# Altium schematic sheet PCIe to SATA.SchDoc
size 609 x 431 mm
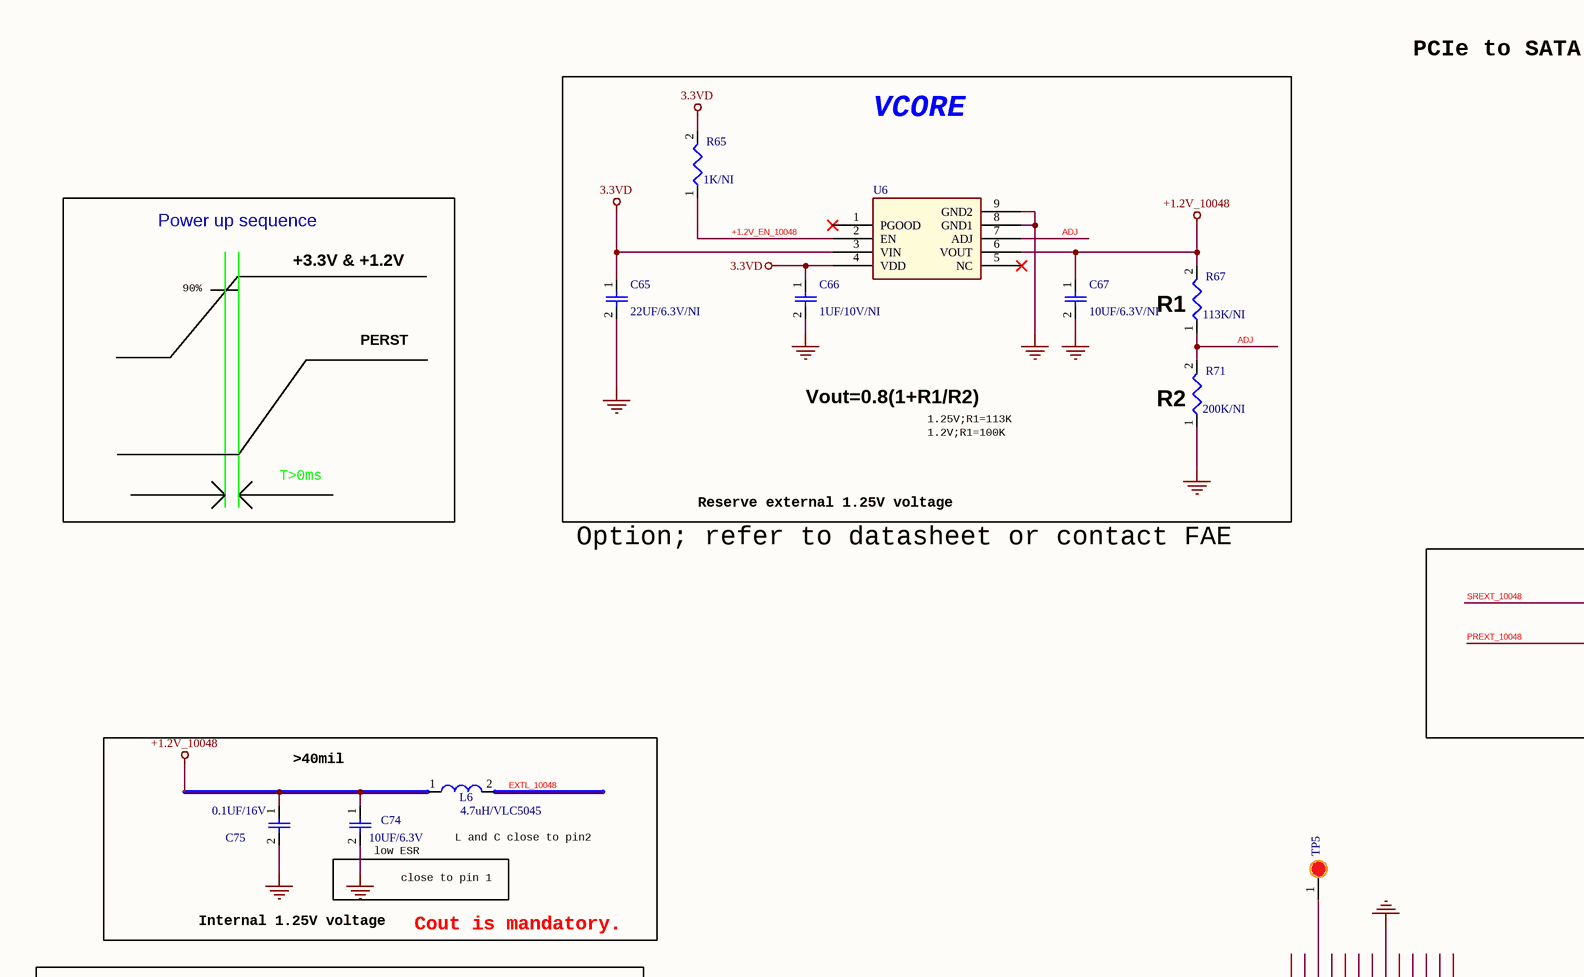
[diagram p0: PCIe to SATA.SchDoc, top left]
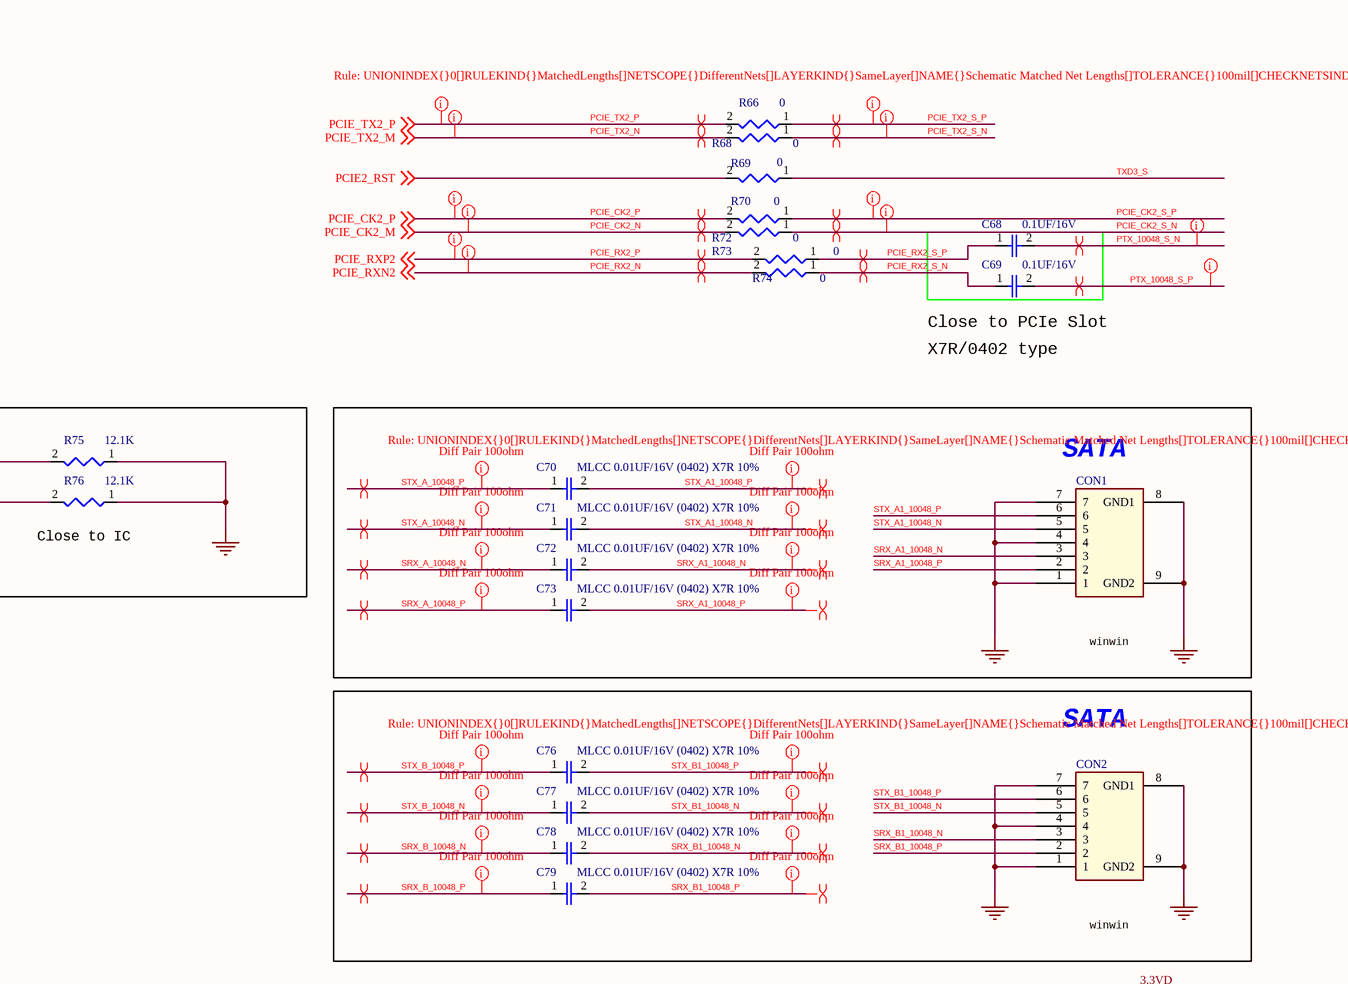
[diagram p1: PCIe to SATA.SchDoc, top right]
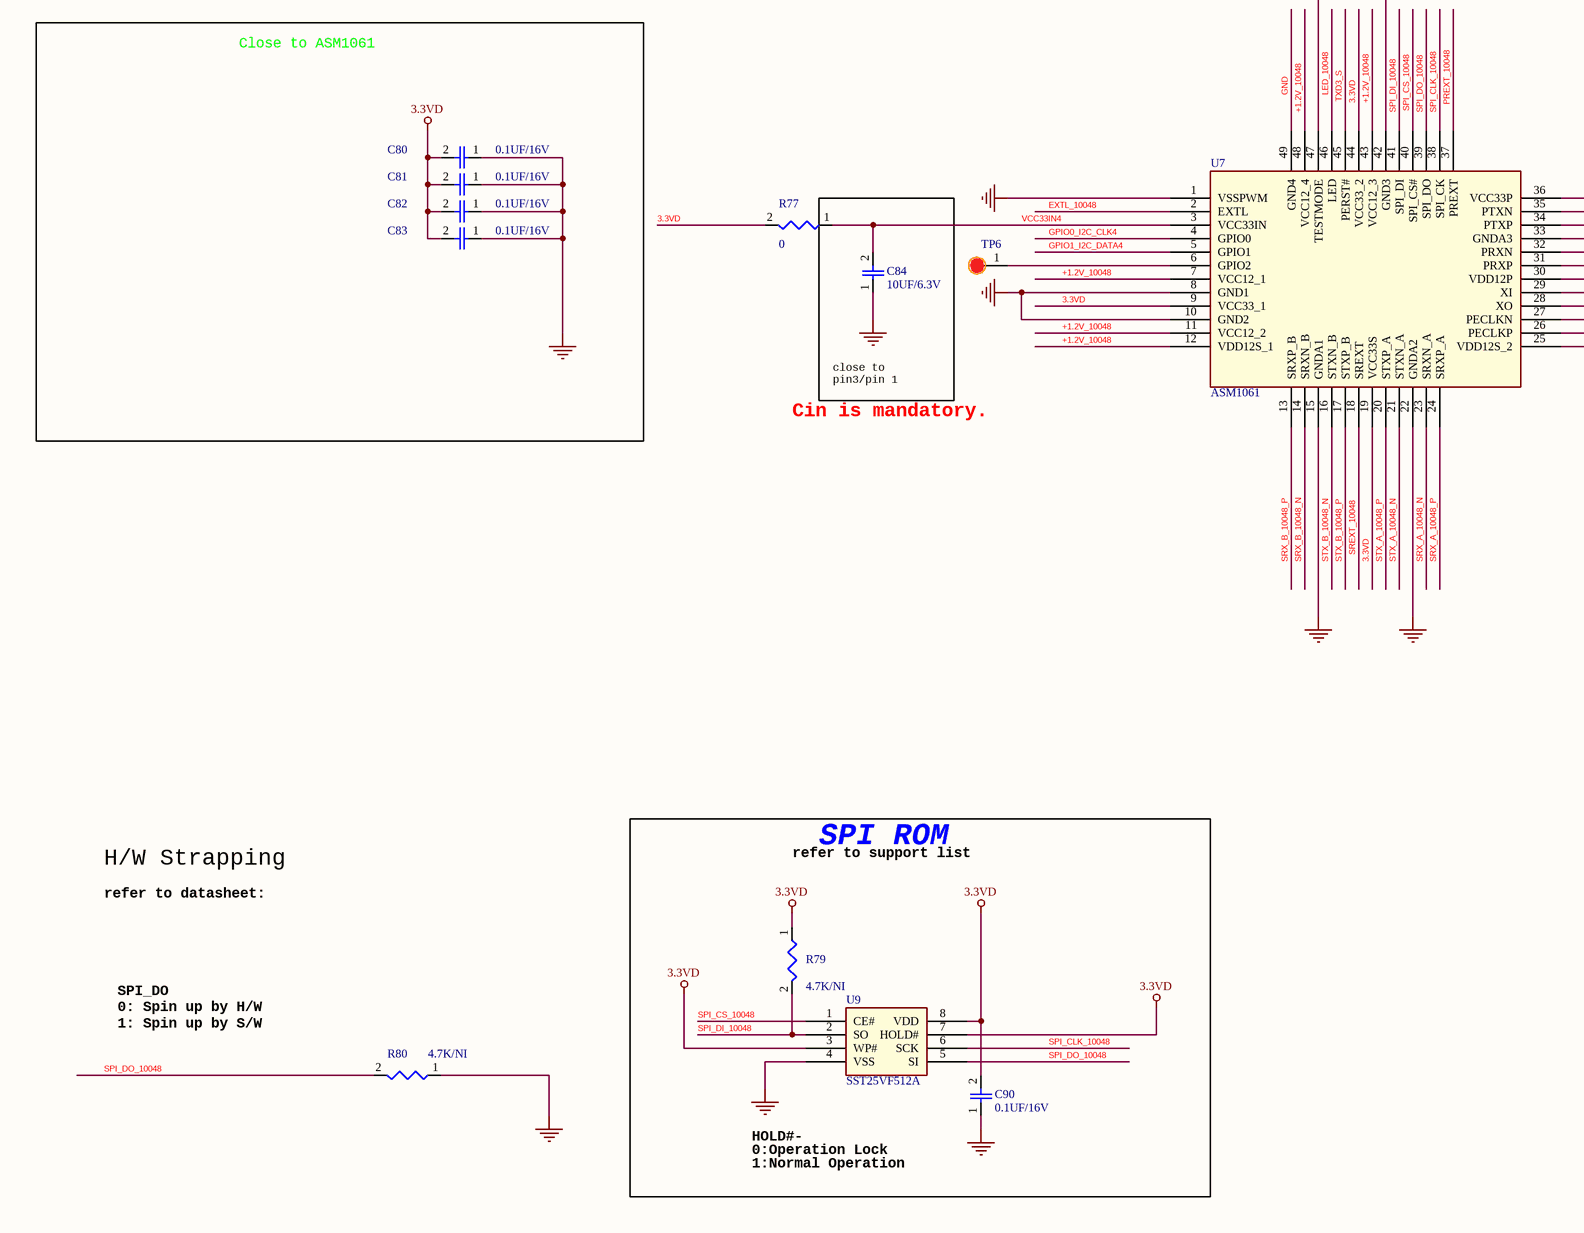
[diagram p2: PCIe to SATA.SchDoc, bottom left]
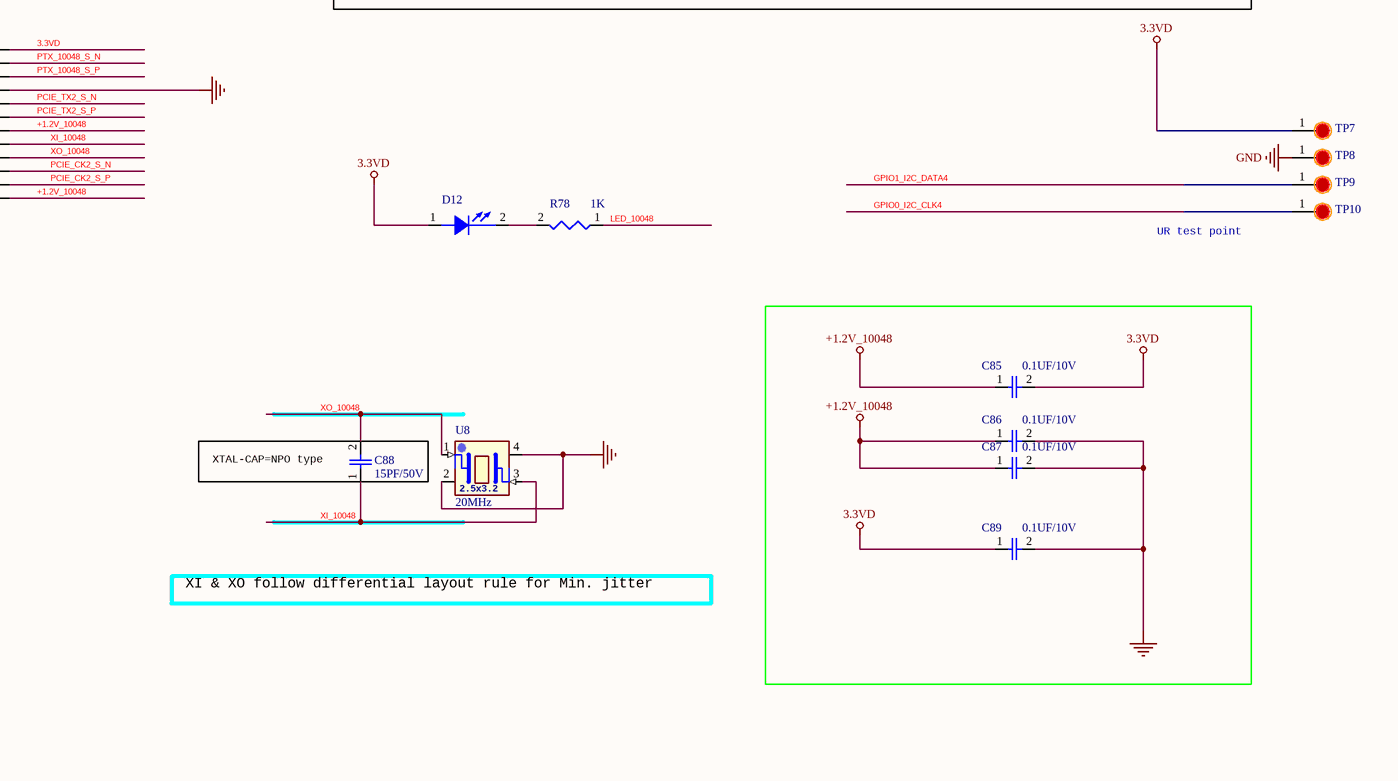
[diagram p3: PCIe to SATA.SchDoc, bottom right]

## Parts
C65  22UF/6.3V/NI  [0805-C]
C66  1UF/10V/NI  [0402-C]
C67  10UF/6.3V/NI  [0603-C]
C68  0.1UF/16V  [0402-C]
C69  0.1UF/16V  [0402-C]
C70  MLCC 0.01UF/16V (0402) X7R 10%  [0402-C]
C71  MLCC 0.01UF/16V (0402) X7R 10%  [0402-C]
C72  MLCC 0.01UF/16V (0402) X7R 10%  [0402-C]
C73  MLCC 0.01UF/16V (0402) X7R 10%  [0402-C]
C74  10UF/6.3V  [0603-C]
C75  0.1UF/16V  [0402-C]
C76  MLCC 0.01UF/16V (0402) X7R 10%  [0402-C]
C77  MLCC 0.01UF/16V (0402) X7R 10%  [0402-C]
C78  MLCC 0.01UF/16V (0402) X7R 10%  [0402-C]
C79  MLCC 0.01UF/16V (0402) X7R 10%  [0402-C]
C80  0.1UF/16V  [0402-C]
C81  0.1UF/16V  [0402-C]
C82  0.1UF/16V  [0402-C]
C83  0.1UF/16V  [0402-C]
C84  10UF/6.3V  [0603-C]
C85  0.1UF/10V  [0402-C]
C86  0.1UF/10V  [0402-C]
C87  0.1UF/10V  [0402-C]
C88  15PF/50V  [0402-C]
C89  0.1UF/10V  [0402-C]
C90  0.1UF/16V  [0402-C]
CON1  SATA_CON_7P_2HOLD  [0678008025]  (value not drawn)
CON2  SATA_CON_7P_2HOLD  [0678008025]  (value not drawn)
D12  LED/0603  [LED_0603]  (value not drawn)
L6  4.7uH/VLC5045  [VLC5045]
R65  1K/NI  [0603-R]
R66  0  [0402-R]
R67  113K/NI  [0402-R]
R68  0  [0402-R]
R69  0  [0402-R]
R70  0  [0402-R]
R71  200K/NI  [0402-R]
R72  0  [0402-R]
R73  0  [0402-R]
R74  0  [0402-R]
R75  12.1K  [0402-R]
R76  12.1K  [0402-R]
R77  0  [0603-R]
R78  1K  [0603-R]
R79  4.7K/NI  [0603-R]
R80  4.7K/NI  [0603-R]
TP5  TP  [TP_SMD]  (value not drawn)
TP6  TP  [TP_SMD]  (value not drawn)
TP7  TP  [TP_SMD]  (value not drawn)
TP8  TP  [TP_SMD]  (value not drawn)
TP9  TP  [TP_SMD]  (value not drawn)
TP10  TP  [TP_SMD]  (value not drawn)
U6  RT9025_25PSP/NI  [SOP-8]  (value not drawn)
U7  ASM1061  [QFN-48]
U8  20MHz  [XTAL_3.2x2.5]
U9  SST25VF512A  [SO-8]

## Blocks framed on the sheet
VCORE: C65-C67 R65 R67 R71 U6
Close to IC: R75 R76
SATA: C70-C73 CON1
Cout is mandatory.: C74 C75 L6
SATA: C76-C79 CON2
Close to ASM1061: C80-C83
XTAL-CAP=NPO type: C88
SPI ROM: C90 R79 U9

## Nets
3.3VD: C65.1 C66.1 C80.2 C81.2 C82.2 C83.2 C85.2 C89.1 C90.2 D12.1(ANODE) R65.2 R77.2 R79.1 TP7.1 U6.3(VIN) U6.4(VDD) U7.9(VCC33_1) U7.19(VCC33S) U7.36(VCC33P) U7.44(VCC33_2) U9.3(WP#) U9.7(HOLD#) U9.8(VDD)
+1.2V_10048: C67.1 C74.1 C75.1 C85.1 C86.1 C87.1 L6.1 R67.2 U6.6(VOUT) U7.7(VCC12_1) U7.11(VCC12_2) U7.12(VDD12S_1) U7.25(VDD12S_2) U7.30(VDD12P) U7.43(VCC12_3) U7.48(VCC12_4)
GND: C65.2 C66.2 C67.2 C74.2 C75.2 C80.1 C81.1 C82.1 C83.1 C84.1 C86.2 C87.2 C89.2 C90.1 CON1.1 CON1.4 CON1.7 CON1.8(GND1) CON1.9(GND2) CON2.1 CON2.4 CON2.7 CON2.8(GND1) CON2.9(GND2) R71.1 R75.1 R76.1 R80.1 TP8.1 U6.8(GND1) U6.9(GND2) U7.1(VSSPWM) U7.8(GND1) U7.10(GND2) U7.15(GNDA1) U7.22(GNDA2) U7.33(GNDA3) U7.42(GND3) U7.49(GND4) U8.2(NC) U8.4(NC) U9.4(VSS)
+1.2V_EN_10048: R65.1 U6.2(EN)
ADJ: R67.1 R71.2 U6.7(ADJ)
EXTL_10048: L6.2 U7.2(EXTL)
GPIO0_I2C_CLK4: TP10.1 U7.4(GPIO0)
GPIO1_I2C_DATA4: TP9.1 U7.5(GPIO1)
LED_10048: R78.1 U7.46(LED)
PCIE2_RST: R69.2 ; off-sheet PCIE2_RST
PCIE_CK2_N: R72.2 ; off-sheet PCIE_CK2_M  [also labelled PCIE_CK2_M]
PCIE_CK2_P: R70.2 ; off-sheet PCIE_CK2_P
PCIE_CK2_S_N: R72.1 U7.27(PECLKN)
PCIE_CK2_S_P: R70.1 U7.26(PECLKP)
PCIE_RX2_N: R74.2 ; off-sheet PCIE_RXN2  [also labelled PCIE_RXN2]
PCIE_RX2_P: R73.2 ; off-sheet PCIE_RXP2  [also labelled PCIE_RXP2]
PCIE_RX2_S_N: C69.1 R74.1
PCIE_RX2_S_P: C68.1 R73.1
PCIE_TX2_N: R68.2 ; off-sheet PCIE_TX2_M  [also labelled PCIE_TX2_M]
PCIE_TX2_P: R66.2 ; off-sheet PCIE_TX2_P
PCIE_TX2_S_N: R68.1 U7.32(PRXN)
PCIE_TX2_S_P: R66.1 U7.31(PRXP)
PREXT_10048: R76.2 U7.37(PREXT)
PTX_10048_S_N: C68.2 U7.35(PTXN)
PTX_10048_S_P: C69.2 U7.34(PTXP)
SPI_CLK_10048: U7.38(SPI_CK) U9.6(SCK)
SPI_CS_10048: U7.40(SPI_CS#) U9.1(CE#)
SPI_DI_10048: R79.2 U7.41(SPI_DI) U9.2(SO)
SPI_DO_10048: R80.2 U7.39(SPI_DO) U9.5(SI)
SREXT_10048: R75.2 U7.18(SREXT)
SRX_A1_10048_N: C72.2 CON1.3
SRX_A1_10048_P: C73.2 CON1.2
SRX_A_10048_N: C72.1 U7.23(SRXN_A)
SRX_A_10048_P: C73.1 U7.24(SRXP_A)
SRX_B1_10048_N: C78.2 CON2.3
SRX_B1_10048_P: C79.2 CON2.2
SRX_B_10048_N: C78.1 U7.14(SRXN_B)
SRX_B_10048_P: C79.1 U7.13(SRXP_B)
STX_A1_10048_N: C71.2 CON1.5
STX_A1_10048_P: C70.2 CON1.6
STX_A_10048_N: C71.1 U7.21(STXN_A)
STX_A_10048_P: C70.1 U7.20(STXP_A)
STX_B1_10048_N: C77.2 CON2.5
STX_B1_10048_P: C76.2 CON2.6
STX_B_10048_N: C77.1 U7.16(STXN_B)
STX_B_10048_P: C76.1 U7.17(STXP_B)
TXD3_S: R69.1 U7.45(PERST#)
VCC33IN4: C84.2 R77.1 U7.3(VCC33IN)
XI_10048: C88.1 U7.29(XI) U8.3(X2)
XO_10048: C88.2 U7.28(XO) U8.1(X1)
NetD12_2: D12.2(CATHODE) R78.2
NetTP5_1: TP5.1 U7.47(TESTMODE)
NetTP6_1: TP6.1 U7.6(GPIO2)

Not connected (* = marked no-connect by the designer): U6 1(PGOOD)* 5(NC)*

## Layout directives
differential pair; differential pair class DIFF100: PCIE_CK2_N, PCIE_CK2_P, PCIE_CK2_S_N, PCIE_CK2_S_P, PCIE_RX2_N, PCIE_RX2_P, PCIE_RX2_S_N, PCIE_RX2_S_P, PCIE_TX2_N, PCIE_TX2_P, PCIE_TX2_S_N, PCIE_TX2_S_P, PTX_10048_S_N, PTX_10048_S_P, SRX_A1_10048_N, SRX_A1_10048_P, SRX_A_10048_N, SRX_A_10048_P, SRX_B1_10048_N, SRX_B1_10048_P, SRX_B_10048_N, SRX_B_10048_P, STX_A1_10048_N, STX_A1_10048_P, STX_A_10048_N, STX_A_10048_P, STX_B1_10048_N, STX_B1_10048_P, STX_B_10048_N, STX_B_10048_P
rule Matched Net Lengths [Tolerance = 100mil]: PCIE_CK2_N, PCIE_CK2_P, PCIE_CK2_S_N, PCIE_CK2_S_P, PCIE_RX2_N, PCIE_RX2_P, PCIE_TX2_N, PCIE_TX2_P, PCIE_TX2_S_N, PCIE_TX2_S_P, PTX_10048_S_N, PTX_10048_S_P, SRX_A1_10048_N, SRX_A1_10048_P, SRX_A_10048_N, SRX_A_10048_P, SRX_B1_10048_N, SRX_B1_10048_P, SRX_B_10048_N, SRX_B_10048_P, STX_A1_10048_N, STX_A1_10048_P, STX_A_10048_N, STX_A_10048_P, STX_B1_10048_N, STX_B1_10048_P, STX_B_10048_N, STX_B_10048_P

## Notes on the sheet
- PCIe to SATA
- Power up sequence
- +3.3V & +1.2V
- 90%
- (near R67) R1
- PERST
- Vout=0.8(1+R1/R2)
- 1.25V;R1=113K
- 1.2V;R1=100K
- (near R71) R2
- (near C69) Close to PCIe Slot
- T>0ms
- Reserve external 1.25V voltage
- X7R/0402 type
- Option; refer to datasheet or contact FAE
- >40mil
- winwin
- (near C74) low ESR
- (near L6) L and C close to pin2
- Internal 1.25V voltage
- close to pin 1
- close to
  pin3/pin 1
- UR test point
- Cin is mandatory.
- XI & XO follow differential layout rule for Min. jitter
- H/W Strapping
- refer to support list
- refer to datasheet:
- SPI_DO
  0: Spin up by H/W
  1: Spin up by S/W
- HOLD#-
- 0:Operation Lock
- 1:Normal Operation
- (in symbol XTAL_3.2x2.5) 2.5x3.2

## Library data of the parts
C65-C90 = CAP
L6 = IND/VLC5045
R65-R80 = Res
TP5-TP10 = Test Pad
U6 = RT9025_25PSP
U8 = XTAL_3.2x2.5
U9 = SST25VF512A: 512 Kbit SPI Serial Flash